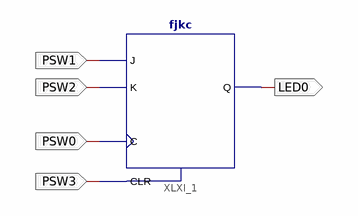
[diagram p0: schematic sheet 1]
// Xilinx ISE schematic lab6_4_jk.sch (spartan3) as structural Verilog: 1 symbols, 5 ports
module lab6_4_jk (
  input  PSW1,
  input  PSW2,
  input  PSW0,
  input  PSW3,
  output LED0
);

  fjkc XLXI_1 (.C(PSW0), .CLR(PSW3), .J(PSW1), .K(PSW2), .Q(LED0));
endmodule
